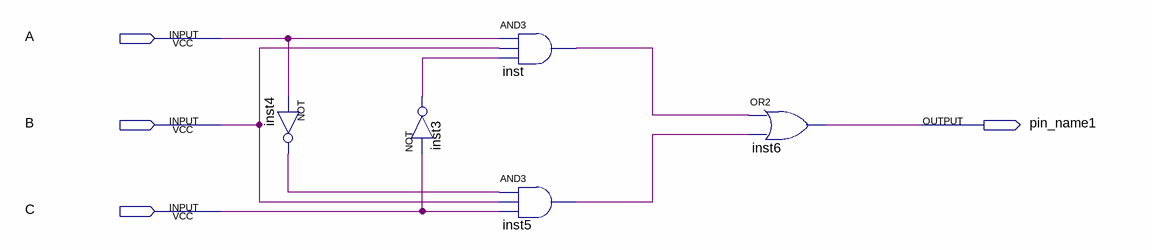
[diagram p0: schematic sheet]
// Quartus schematic Block4.bdf as structural Verilog: 5 symbols, 4 pins
module Block4 (
  input  A,
  input  B,
  input  C,
  output pin_name1
);

  wire inst3_out, inst4_out, inst5_out, inst_out;

  not inst4 (inst4_out, A);
  not inst3 (inst3_out, C);
  and inst (inst_out, A, B, inst3_out);
  and inst5 (inst5_out, inst4_out, B, C);
  or inst6 (pin_name1, inst_out, inst5_out);
endmodule
